# Altium project Terra.PrjPcb (part 2 of 3)

## Sheet Xilinx_DDR.SchDoc
size A3; Author: Швецов С.В.; Organization: PapuaSoft; SheetNumber: 6; SheetTotal: 8
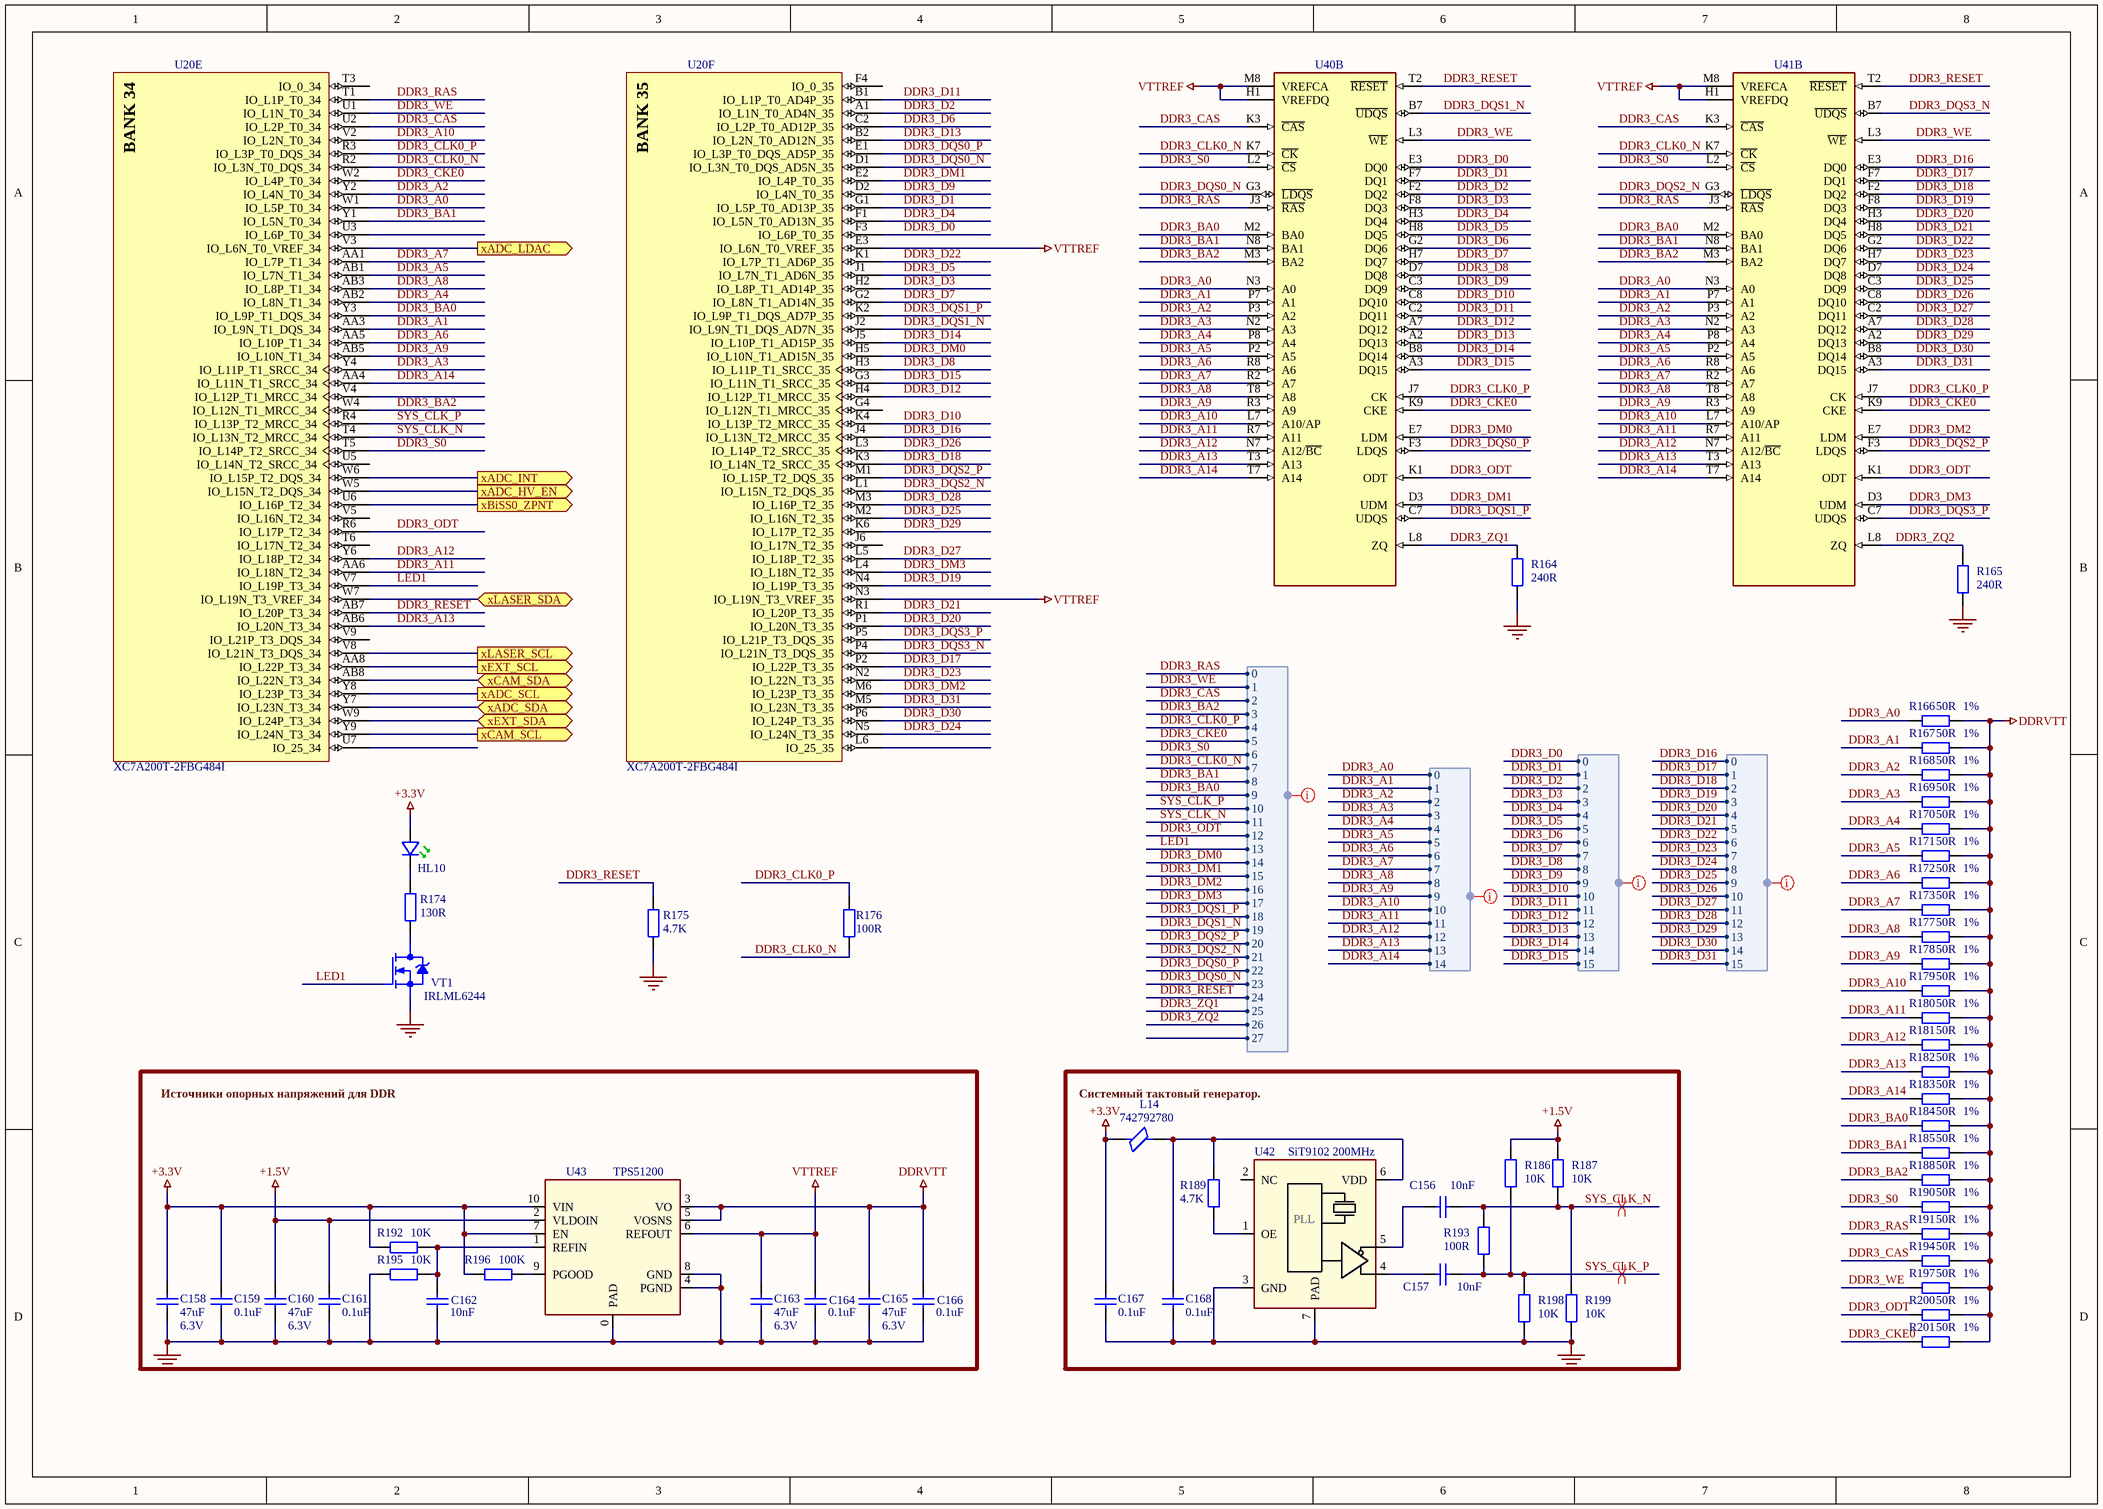
[diagram p5: Xilinx_DDR.SchDoc]

### Parts
C156  value 10nF  [C0402]  (hidden comment: Cap)
C157  value 10nF  [C0402]  (hidden comment: Cap)
C158  value 47uF  Voltage: 6.3V  [C0805]  (hidden comment: Cap)
C159  value 0.1uF  [C0402]  (hidden comment: Cap)
C160  value 47uF  Voltage: 6.3V  [C0805]  (hidden comment: Cap)
C161  value 0.1uF  [C0402]  (hidden comment: Cap)
C162  value 10nF  [C0402]  (hidden comment: Cap)
C163  value 47uF  Voltage: 6.3V  [C0805]  (hidden comment: Cap)
C164  value 0.1uF  [C0402]  (hidden comment: Cap)
C165  value 47uF  Voltage: 6.3V  [C0805]  (hidden comment: Cap)
C166  value 0.1uF  [C0402]  (hidden comment: Cap)
C167  value 0.1uF  [C0402]  (hidden comment: Cap)
C168  value 0.1uF  [C0402]  (hidden comment: Cap)
HL10  (no value)  [KP-1608_16x08x11_L]
L14  742792780  [L0402]
R164  value 240R  [R0402]  (hidden comment: Res2)
R165  value 240R  [R0402]  (hidden comment: Res2)
R166  value 50R  Precision: 1%  [R0402]  (hidden comment: Res2)
R167  value 50R  Precision: 1%  [R0402]  (hidden comment: Res2)
R168  value 50R  Precision: 1%  [R0402]  (hidden comment: Res2)
R169  value 50R  Precision: 1%  [R0402]  (hidden comment: Res2)
R170  value 50R  Precision: 1%  [R0402]  (hidden comment: Res2)
R171  value 50R  Precision: 1%  [R0402]  (hidden comment: Res2)
R172  value 50R  Precision: 1%  [R0402]  (hidden comment: Res2)
R173  value 50R  Precision: 1%  [R0402]  (hidden comment: Res2)
R174  value 130R  [R0402]  (hidden comment: Res2)
R175  value 4.7K  [R0402]  (hidden comment: Res2)
R176  value 100R  [R0402]  (hidden comment: Res2)
R177  value 50R  Precision: 1%  [R0402]  (hidden comment: Res2)
R178  value 50R  Precision: 1%  [R0402]  (hidden comment: Res2)
R179  value 50R  Precision: 1%  [R0402]  (hidden comment: Res2)
R180  value 50R  Precision: 1%  [R0402]  (hidden comment: Res2)
R181  value 50R  Precision: 1%  [R0402]  (hidden comment: Res2)
R182  value 50R  Precision: 1%  [R0402]  (hidden comment: Res2)
R183  value 50R  Precision: 1%  [R0402]  (hidden comment: Res2)
R184  value 50R  Precision: 1%  [R0402]  (hidden comment: Res2)
R185  value 50R  Precision: 1%  [R0402]  (hidden comment: Res2)
R186  value 10K  [R0402]  (hidden comment: Res2)
R187  value 10K  [R0402]  (hidden comment: Res2)
R188  value 50R  Precision: 1%  [R0402]  (hidden comment: Res2)
R189  value 4.7K  [R0402]  (hidden comment: Res2)
R190  value 50R  Precision: 1%  [R0402]  (hidden comment: Res2)
R191  value 50R  Precision: 1%  [R0402]  (hidden comment: Res2)
R192  value 10K  [R0402]  (hidden comment: Res2)
R193  value 100R  [R0402]  (hidden comment: Res2)
R194  value 50R  Precision: 1%  [R0402]  (hidden comment: Res2)
R195  value 10K  [R0402]  (hidden comment: Res2)
R196  value 100K  [R0402]  (hidden comment: Res2)
R197  value 50R  Precision: 1%  [R0402]  (hidden comment: Res2)
R198  value 10K  [R0402]  (hidden comment: Res2)
R199  value 10K  [R0402]  (hidden comment: Res2)
R200  value 50R  Precision: 1%  [R0402]  (hidden comment: Res2)
R201  value 50R  Precision: 1%  [R0402]  (hidden comment: Res2)
U20  XC7A200T-2FBG484I  [FBG484]  (parts E,F of 11)
U40  MT41J256M16HA-125-E  [FBGA96_9X14_MRN]  (value not drawn)  (part B of 2)
U41  MT41J256M16HA-125-E  [FBGA96_9X14_MRN]  (value not drawn)  (part B of 2)
U42  SiT9102 200MHz  [SMD_AI-243N33E200.00000X_SIT-L]
U43  TPS51200  [TPS51200AQDRCRQ1]
VT1  IRLML6244  [SOT23_123]

### Ports
xADC_HV_EN (out), xADC_INT (out), xADC_LDAC (out), xADC_SCL (out), xADC_SDA (bidir), xBiSS0_ZPNT (out), xCAM_SCL (out), xCAM_SDA (bidir), xEXT_SCL (out), xEXT_SDA (bidir), xLASER_SCL (out), xLASER_SDA (bidir)

### Harnesses
DDR3_DATA: 0, 1, 2, 3, 4, 5, 6, 7, 8, 9, 10, 12, 13, 14, 15, 11
DDR3_ADDR: 0, 1, 2, 3, 4, 5, 6, 7, 8, 9, 10, 12, 13, 14, 11
DDR3_ADDR: 0, 1, 2, 3, 4, 5, 6, 7, 8, 9, 10, 12, 13, 14, 11, 15, 16, 17, 18, 19, 20, 21, 22, 23, 24, 25, 26, 27

### Nets
+1.5V: C160.1 C161.2 R186.1 R187.1 U43.2(VLDOIN)
+3.3V: C158.1 C159.2 C167.2 HL10.1(Anode) L14.1 R192.1 R196.1 U43.7(EN) U43.10(VIN)
DDRVTT: C165.1 C166.1 R166.2 R167.2 R168.2 R169.2 R170.2 R171.2 R172.2 R173.2 R177.2 R178.2 R179.2 R180.2 R181.2 R182.2 R183.2 R184.2 R185.2 R188.2 R190.2 R191.2 R194.2 R197.2 R200.2 R201.2 U43.3(VO) U43.5(VOSNS)
GND: C158.2 C159.1 C160.2 C161.1 C162.2 C163.2 C164.2 C165.2 C166.2 C167.1 C168.1 R164.1 R165.1 R175.1 R195.1 R198.2 R199.2 U42.3(GND) U42.7(PAD) U43.0(PAD) U43.4(PGND) U43.8(GND) VT1.2(Sourse)  [project net +12V_INPUT]
VTTREF: C163.1 C164.1 U20.E3(IO_L6N_T0_VREF_35) U20.N3(IO_L19N_T3_VREF_35) U40.H1(VREFDQ) U40.M8(VREFCA) U41.H1(VREFDQ) U41.M8(VREFCA) U43.6(REFOUT)
DDR3_A0: R166.1 U20.W1(IO_L5P_T0_34) U40.N3(A0) U41.N3(A0) ; harness DDR3_ADDR.0
DDR3_A1: R167.1 U20.AA3(IO_L9N_T1_DQS_34) U40.P7(A1) U41.P7(A1) ; harness DDR3_ADDR.1
DDR3_A2: R168.1 U20.Y2(IO_L4N_T0_34) U40.P3(A2) U41.P3(A2) ; harness DDR3_ADDR.2
DDR3_A3: R169.1 U20.Y4(IO_L11P_T1_SRCC_34) U40.N2(A3) U41.N2(A3) ; harness DDR3_ADDR.3
DDR3_A4: R170.1 U20.AB2(IO_L8N_T1_34) U40.P8(A4) U41.P8(A4) ; harness DDR3_ADDR.4
DDR3_A5: R171.1 U20.AB1(IO_L7N_T1_34) U40.P2(A5) U41.P2(A5) ; harness DDR3_ADDR.5
DDR3_A6: R172.1 U20.AA5(IO_L10P_T1_34) U40.R8(A6) U41.R8(A6) ; harness DDR3_ADDR.6
DDR3_A7: R173.1 U20.AA1(IO_L7P_T1_34) U40.R2(A7) U41.R2(A7) ; harness DDR3_ADDR.7
DDR3_A8: R177.1 U20.AB3(IO_L8P_T1_34) U40.T8(A8) U41.T8(A8) ; harness DDR3_ADDR.8
DDR3_A9: R178.1 U20.AB5(IO_L10N_T1_34) U40.R3(A9) U41.R3(A9) ; harness DDR3_ADDR.9
DDR3_A10: R179.1 U20.V2(IO_L2N_T0_34) U40.L7(A10/AP) U41.L7(A10/AP) ; harness DDR3_ADDR.10
DDR3_A11: R180.1 U20.AA6(IO_L18N_T2_34) U40.R7(A11) U41.R7(A11) ; harness DDR3_ADDR.11
DDR3_A12: R181.1 U20.Y6(IO_L18P_T2_34) U40.N7(A12/~{BC}) U41.N7(A12/~{BC}) ; harness DDR3_ADDR.12
DDR3_A13: R182.1 U20.AB6(IO_L20N_T3_34) U40.T3(A13) U41.T3(A13) ; harness DDR3_ADDR.13
DDR3_A14: R183.1 U20.AA4(IO_L11N_T1_SRCC_34) U40.T7(A14) U41.T7(A14) ; harness DDR3_ADDR.14
DDR3_BA0: R184.1 U20.Y3(IO_L9P_T1_DQS_34) U40.M2(BA0) U41.M2(BA0) ; harness DDR3_ADDR.9
DDR3_BA1: R185.1 U20.Y1(IO_L5N_T0_34) U40.N8(BA1) U41.N8(BA1) ; harness DDR3_ADDR.8
DDR3_BA2: R188.1 U20.W4(IO_L12N_T1_MRCC_34) U40.M3(BA2) U41.M3(BA2) ; harness DDR3_ADDR.3
DDR3_CAS: R194.1 U20.U2(IO_L2P_T0_34) U40.K3(~{CAS}) U41.K3(~{CAS}) ; harness DDR3_ADDR.2
DDR3_CKE0: R201.1 U20.W2(IO_L4P_T0_34) U40.K9(CKE) U41.K9(CKE) ; harness DDR3_ADDR.5
DDR3_CLK0_N: R176.2 U20.R2(IO_L3N_T0_DQS_34) U40.K7(~{CK}) U41.K7(~{CK}) ; harness DDR3_ADDR.7
DDR3_CLK0_P: R176.1 U20.R3(IO_L3P_T0_DQS_34) U40.J7(CK) U41.J7(CK) ; harness DDR3_ADDR.4
DDR3_D0: U20.F3(IO_L6P_T0_35) U40.E3(DQ0) ; harness DDR3_DATA.0
DDR3_D1: U20.G1(IO_L5P_T0_AD13P_35) U40.F7(DQ1) ; harness DDR3_DATA.1
DDR3_D2: U20.A1(IO_L1N_T0_AD4N_35) U40.F2(DQ2) ; harness DDR3_DATA.2
DDR3_D3: U20.H2(IO_L8P_T1_AD14P_35) U40.F8(DQ3) ; harness DDR3_DATA.3
DDR3_D4: U20.F1(IO_L5N_T0_AD13N_35) U40.H3(DQ4) ; harness DDR3_DATA.4
DDR3_D5: U20.J1(IO_L7N_T1_AD6N_35) U40.H8(DQ5) ; harness DDR3_DATA.5
DDR3_D6: U20.C2(IO_L2P_T0_AD12P_35) U40.G2(DQ6) ; harness DDR3_DATA.6
DDR3_D7: U20.G2(IO_L8N_T1_AD14N_35) U40.H7(DQ7) ; harness DDR3_DATA.7
DDR3_D8: U20.H3(IO_L11P_T1_SRCC_35) U40.D7(DQ8) ; harness DDR3_DATA.8
DDR3_D9: U20.D2(IO_L4N_T0_35) U40.C3(DQ9) ; harness DDR3_DATA.9
DDR3_D10: U20.K4(IO_L13P_T2_MRCC_35) U40.C8(DQ10) ; harness DDR3_DATA.10
DDR3_D11: U20.B1(IO_L1P_T0_AD4P_35) U40.C2(DQ11) ; harness DDR3_DATA.11
DDR3_D12: U20.H4(IO_L12P_T1_MRCC_35) U40.A7(DQ12) ; harness DDR3_DATA.12
DDR3_D13: U20.B2(IO_L2N_T0_AD12N_35) U40.A2(DQ13) ; harness DDR3_DATA.13
DDR3_D14: U20.J5(IO_L10P_T1_AD15P_35) U40.B8(DQ14) ; harness DDR3_DATA.14
DDR3_D15: U20.G3(IO_L11N_T1_SRCC_35) U40.A3(DQ15) ; harness DDR3_DATA.15
DDR3_D16: U20.J4(IO_L13N_T2_MRCC_35) U41.E3(DQ0) ; harness DDR3_DATA.0
DDR3_D17: U20.P2(IO_L22P_T3_35) U41.F7(DQ1) ; harness DDR3_DATA.1
DDR3_D18: U20.K3(IO_L14N_T2_SRCC_35) U41.F2(DQ2) ; harness DDR3_DATA.2
DDR3_D19: U20.N4(IO_L19P_T3_35) U41.F8(DQ3) ; harness DDR3_DATA.3
DDR3_D20: U20.P1(IO_L20N_T3_35) U41.H3(DQ4) ; harness DDR3_DATA.4
DDR3_D21: U20.R1(IO_L20P_T3_35) U41.H8(DQ5) ; harness DDR3_DATA.5
DDR3_D22: U20.K1(IO_L7P_T1_AD6P_35) U41.G2(DQ6) ; harness DDR3_DATA.6
DDR3_D23: U20.N2(IO_L22N_T3_35) U41.H7(DQ7) ; harness DDR3_DATA.7
DDR3_D24: U20.N5(IO_L24N_T3_35) U41.D7(DQ8) ; harness DDR3_DATA.8
DDR3_D25: U20.M2(IO_L16N_T2_35) U41.C3(DQ9) ; harness DDR3_DATA.9
DDR3_D26: U20.L3(IO_L14P_T2_SRCC_35) U41.C8(DQ10) ; harness DDR3_DATA.10
DDR3_D27: U20.L5(IO_L18P_T2_35) U41.C2(DQ11) ; harness DDR3_DATA.11
DDR3_D28: U20.M3(IO_L16P_T2_35) U41.A7(DQ12) ; harness DDR3_DATA.12
DDR3_D29: U20.K6(IO_L17P_T2_35) U41.A2(DQ13) ; harness DDR3_DATA.13
DDR3_D30: U20.P6(IO_L24P_T3_35) U41.B8(DQ14) ; harness DDR3_DATA.14
DDR3_D31: U20.M5(IO_L23N_T3_35) U41.A3(DQ15) ; harness DDR3_DATA.15
DDR3_DM0: U20.H5(IO_L10N_T1_AD15N_35) U40.E7(LDM) ; harness DDR3_ADDR.14
DDR3_DM1: U20.E2(IO_L4P_T0_35) U40.D3(UDM) ; harness DDR3_ADDR.15
DDR3_DM2: U20.M6(IO_L23P_T3_35) U41.E7(LDM) ; harness DDR3_ADDR.16
DDR3_DM3: U20.L4(IO_L18N_T2_35) U41.D3(UDM) ; harness DDR3_ADDR.17
DDR3_DQS0_N: U20.D1(IO_L3N_T0_DQS_AD5N_35) U40.G3(~{LDQS}) ; harness DDR3_ADDR.23
DDR3_DQS0_P: U20.E1(IO_L3P_T0_DQS_AD5P_35) U40.F3(LDQS) ; harness DDR3_ADDR.22
DDR3_DQS1_N: U20.J2(IO_L9N_T1_DQS_AD7N_35) U40.B7(~{UDQS}) ; harness DDR3_ADDR.19
DDR3_DQS1_P: U20.K2(IO_L9P_T1_DQS_AD7P_35) U40.C7(UDQS) ; harness DDR3_ADDR.18
DDR3_DQS2_N: U20.L1(IO_L15N_T2_DQS_35) U41.G3(~{LDQS}) ; harness DDR3_ADDR.21
DDR3_DQS2_P: U20.M1(IO_L15P_T2_DQS_35) U41.F3(LDQS) ; harness DDR3_ADDR.20
DDR3_DQS3_N: U20.P4(IO_L21N_T3_DQS_35) U41.B7(~{UDQS})
DDR3_DQS3_P: U20.P5(IO_L21P_T3_DQS_35) U41.C7(UDQS)
DDR3_ODT: R200.1 U20.R6(IO_L17P_T2_34) U40.K1(ODT) U41.K1(ODT) ; harness DDR3_ADDR.12
DDR3_RAS: R191.1 U20.T1(IO_L1P_T0_34) U40.J3(~{RAS}) U41.J3(~{RAS}) ; harness DDR3_ADDR.0
DDR3_RESET: R175.2 U20.AB7(IO_L20P_T3_34) U40.T2(~{RESET}) U41.T2(~{RESET}) ; harness DDR3_ADDR.24
DDR3_S0: R190.1 U20.T5(IO_L14P_T2_SRCC_34) U40.L2(~{CS}) U41.L2(~{CS}) ; harness DDR3_ADDR.6
DDR3_WE: R197.1 U20.U1(IO_L1N_T0_34) U40.L3(~{WE}) U41.L3(~{WE}) ; harness DDR3_ADDR.1
DDR3_ZQ1: R164.2 U40.L8(ZQ) ; harness DDR3_ADDR.25
DDR3_ZQ2: R165.2 U41.L8(ZQ) ; harness DDR3_ADDR.26
LED1: U20.V7(IO_L19P_T3_34) VT1.1(Gate) ; harness DDR3_ADDR.13
SYS_CLK_N: C156.2 R187.2 R193.1 R199.1 U20.T4(IO_L13N_T2_MRCC_34) ; harness DDR3_ADDR.11
SYS_CLK_P: C157.2 R186.2 R193.2 R198.1 U20.R4(IO_L13P_T2_MRCC_34) ; harness DDR3_ADDR.10
xADC_HV_EN: U20.W5(IO_L15N_T2_DQS_34) ; port xADC_HV_EN
xADC_INT: U20.W6(IO_L15P_T2_DQS_34) ; port xADC_INT
xADC_LDAC: U20.V3(IO_L6N_T0_VREF_34) ; port xADC_LDAC
xADC_SCL: U20.Y8(IO_L23P_T3_34) ; port xADC_SCL
xADC_SDA: U20.Y7(IO_L23N_T3_34) ; port xADC_SDA
xBiSS0_ZPNT: U20.U6(IO_L16P_T2_34) ; port xBiSS0_ZPNT
xBiSS1_CLK: U20.AA8(IO_L22P_T3_34) ; port xEXT_SCL
xCAM_SCL: U20.Y9(IO_L24N_T3_34) ; port xCAM_SCL
xCAM_SDA: U20.AB8(IO_L22N_T3_34) ; port xCAM_SDA
xEXT_SDA: U20.W9(IO_L24P_T3_34) ; port xEXT_SDA
xLS_SCL: U20.V8(IO_L21N_T3_DQS_34) ; port xLASER_SCL
xLS_SDA: U20.W7(IO_L19N_T3_VREF_34) ; port xLASER_SDA
NetC156_1: C156.1 U42.5(CLKN)
NetC157_1: C157.1 U42.4(CLKP)
NetC162_1: C162.1 R192.2 R195.2 U43.1(REFIN)
NetC168_2: C168.2 L14.2 R189.2 U42.6(VDD)
NetHL10_2: HL10.2(Cathode) R174.2
NetR174_1: R174.1 VT1.3(Drain)
NetR189_1: R189.1 U42.1(OE)
NetR196_2: R196.2 U43.9(PGOOD)

Not connected (* = marked no-connect by the designer): U20 F4(IO_0_35) G4(IO_L12N_T1_MRCC_35) J6(IO_L17N_T2_35) L6(IO_25_35) T3(IO_0_34) T6(IO_L17N_T2_34) U3(IO_L6P_T0_34) U5(IO_L14N_T2_SRCC_34) U7(IO_25_34) V4(IO_L12P_T1_MRCC_34) V5(IO_L16N_T2_34) V9(IO_L21P_T3_DQS_34); U42 2(NC); U43 173 174

### Layout directives
net class DDR_DATA_0_15: (no net found under the mark)
net class DDR_DATA_16_31: (no net found under the mark)
net class DDR_ADDR: (no net found under the mark)
net class PLIS_OTHER: (no net found under the mark)
differential pair: SYS_CLK_N, SYS_CLK_P

### Notes on the sheet
- Источники опорных напряжений для DDR
- (near L14) Системный тактовый генератор.
- Лист
- /
- Изм.
- № докум.
- Подп.
- Дата.
- (in symbol SiT9102) PLL
- (in symbol XC7A200T-2FBG484I, part E) BANK 34
- (in symbol XC7A200T-2FBG484I, part F) BANK 35

### Library data of the parts
C156 C157 C159 C161 C162 C164 C166-C168 = Cap: Конденсатор керамический; Voltage: 25V; PackageReference: 0402
  C156 C157 C159 C161 C167 C168: ClassName: SystemCLK
  C162 C164 C166: ClassName: Xilinx DDR
C158 C160 C163 C165 = Cap: C0805C476M9PAC; PackageReference: 0805; ClassName: Xilinx PWR
HL10 = ledG_KP-1608MGC_KP-1608: 1.6X0.8mm SMD  LED; LxWxH(mm): 1,6x0,8x1,1; Value: KP-1608MGC; PackageReference: 0603; Package: KP-1608_16x08x11
L14 = BEAD_FERRITE_SM: Wurth Elektronik EMI FILTERS FERRITE BEAD, 220R@100MHz, 0.35R; PackageReference: 0402; Value: 742792780; ClassName: SystemCLK
R164-R191 R193 R194 R196-R201 = Res2: Резистор; PackageReference: 0402
  R164-R173 R175-R185 R188 R190 R191 R194 R196 R197 R200 R201: ClassName: Xilinx DDR
  R186 R187 R189 R193 R198 R199: ClassName: SystemCLK
R192 R195 = Res2: Резистор; Precision: 1%; PackageReference: 0402; ClassName: Xilinx DDR
U20 = XC7A200T-2FBG484I: Artix-7 FPGA, 285 User I/Os, 4 GTP, 484-Ball BGA; Manufacturer: Xilinx; CLBs (Slices): 33650; DSP48E1 Slices: 740; Block RAM Blocks (36Kb): 365; Logic Cells: 215360; Block RAM Blocks (Max Kb): 13140; Speed Grade: -2; Clock Mgmt Tiles (CMTs): 10; Block RAM Blocks (18Kb): 730; Max User I/O: 500; ComponentLink5Description: Packaging and Pinout; CLBs (Max Distributed RAM Kb): 2888; ComponentLink4Description: Package File; ComponentLink5URL: http://www.xilinx.com/support/documentation/user_guides/ug475_7Series_Pkg_Pinout.pdf; ComponentLink1Description: Datasheet; ComponentLink2Description: Package Specification; DatasheetVersion: v1.12; ComponentLink3URL: http://www.xilinx.com/support/documentation/data_sheets/ds181_Artix_7_Data_Sheet.pdf; ComponentLink1URL: http://www.xilinx.com/support/documentation/data_sheets/ds180_7Series_Overview.pdf; Code_JEDEC: MS-034; ComponentLink2URL: http://www.xilinx.com/support/documentation/user_guides/ug475_7Series_Pkg_Pinout.pdf; ComponentLink3Description: DC and Switching Characteristics; Generic Part Number: XC7A200T; RoHS: Pb-Free; ComponentLink4URL: http://www.xilinx.com/support/packagefiles/a7packages/xc7a200tfbg484pkg.txt; PackageVersion: Rev 1.8; Mounting Technology: Surface Mount; PackageReference: FBG484; PackageDescription: Flip-Chip Lidless BGA, Body 23 x 23 mm, 1.0 mm Pitch; Value: XC7A200T-2FBG484I; ClassName: *
U40 U41 = MT41J256M16HA-125-E: DDR3 SDRAM 32Meg x 16 x 8 banks; Value: MT41J256M16HA-125-E; PackageReference: FBGA-96
U42 = SiT9102: 200 MHz XO LVDS Oscillator 3.3V; Value: SIT9102AI-243N33E200.00000X; PackageReference: SMD 5.0x3.2x0.75; ClassName: SystemCLK
U43 = TPS51200: Sink and Source DDR Termination Regulator; Value: TPS51200; PackageReference: VSON10; ClassName: Xilinx DDR
VT1 = MOSFET-N/SOT23: MOSFET-N 1.5V порог переключения.; Value: IRLML6244TRPbF; PackageReference: SOT23

## Sheet Xilinx_pwr.SchDoc
size A3; Author: Швецов С.В.; Organization: PapuaSoft; SheetNumber: 6; SheetTotal: 8
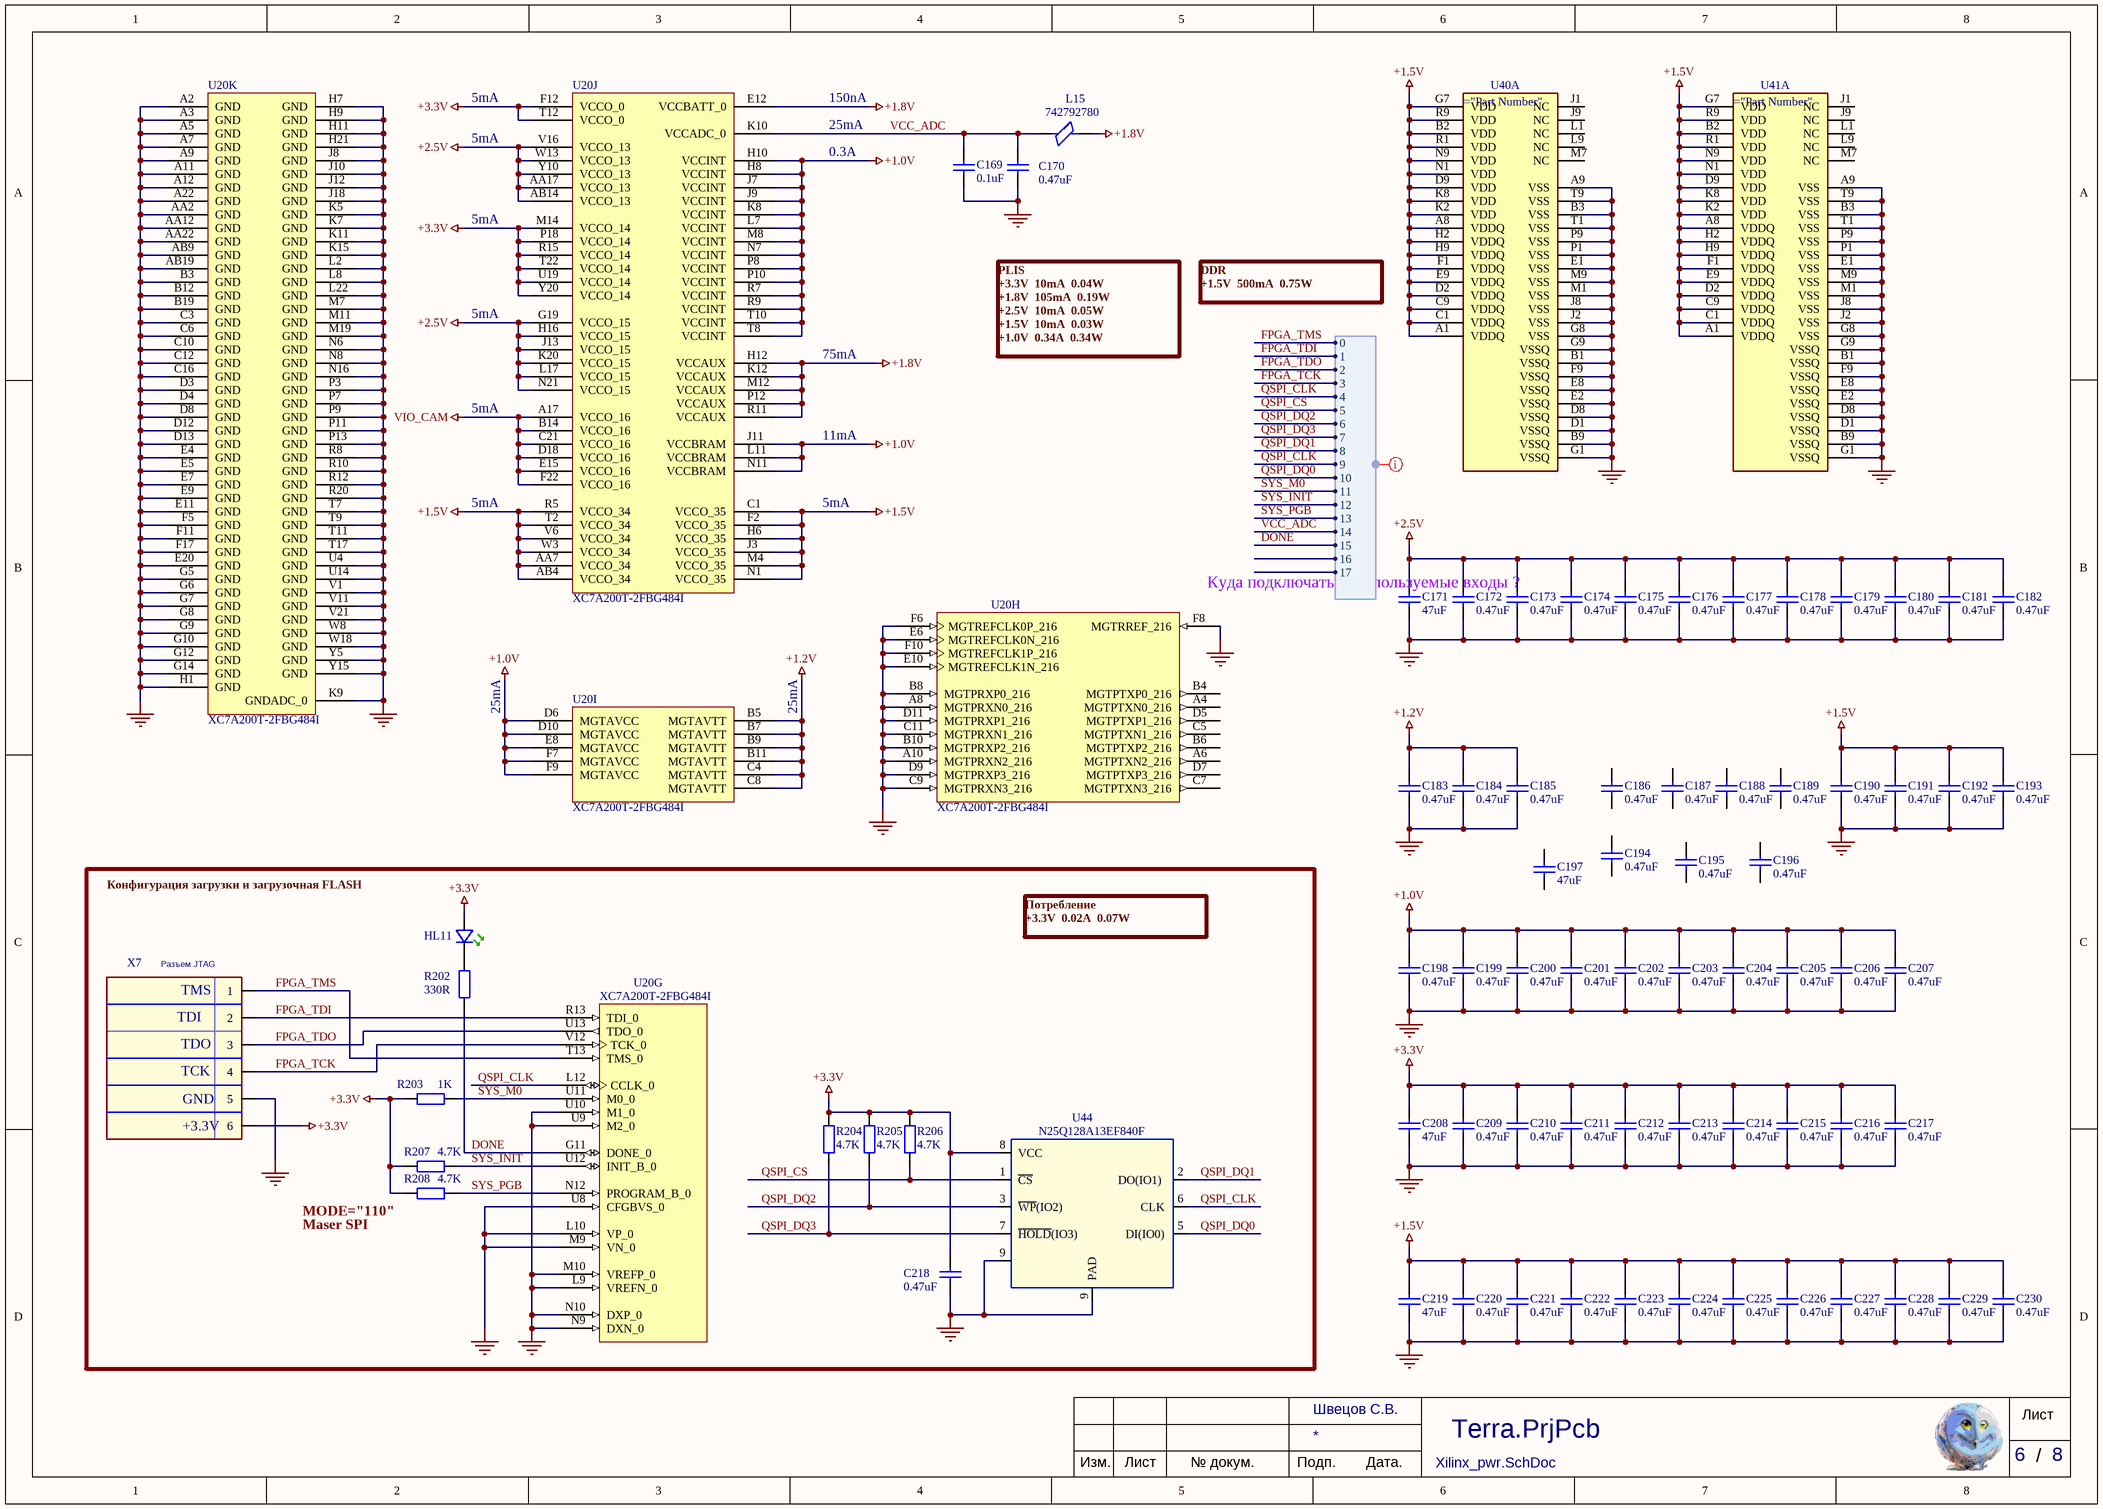
[diagram p6: Xilinx_pwr.SchDoc]

### Parts
C169  value 0.1uF  [C0402]  (hidden comment: Cap)
C170  value 0.47uF  [C0402]  (hidden comment: Cap)
C171  value 47uF  [C0805]  (hidden comment: Cap)
C172  value 0.47uF  [C0402]  (hidden comment: Cap)
C173  value 0.47uF  [C0402]  (hidden comment: Cap)
C174  value 0.47uF  [C0402]  (hidden comment: Cap)
C175  value 0.47uF  [C0402]  (hidden comment: Cap)
C176  value 0.47uF  [C0402]  (hidden comment: Cap)
C177  value 0.47uF  [C0402]  (hidden comment: Cap)
C178  value 0.47uF  [C0402]  (hidden comment: Cap)
C179  value 0.47uF  [C0402]  (hidden comment: Cap)
C180  value 0.47uF  [C0402]  (hidden comment: Cap)
C181  value 0.47uF  [C0402]  (hidden comment: Cap)
C182  value 0.47uF  [C0402]  (hidden comment: Cap)
C183  value 0.47uF  [C0402]  (hidden comment: Cap)
C184  value 0.47uF  [C0402]  (hidden comment: Cap)
C185  value 0.47uF  [C0402]  (hidden comment: Cap)
C186  value 0.47uF  [C0402]  (hidden comment: Cap)
C187  value 0.47uF  [C0402]  (hidden comment: Cap)
C188  value 0.47uF  [C0402]  (hidden comment: Cap)
C189  value 0.47uF  [C0402]  (hidden comment: Cap)
C190  value 0.47uF  [C0402]  (hidden comment: Cap)
C191  value 0.47uF  [C0402]  (hidden comment: Cap)
C192  value 0.47uF  [C0402]  (hidden comment: Cap)
C193  value 0.47uF  [C0402]  (hidden comment: Cap)
C194  value 0.47uF  [C0402]  (hidden comment: Cap)
C195  value 0.47uF  [C0402]  (hidden comment: Cap)
C196  value 0.47uF  [C0402]  (hidden comment: Cap)
C197  value 47uF  [C0805]  (hidden comment: Cap)
C198  value 0.47uF  [C0402]  (hidden comment: Cap)
C199  value 0.47uF  [C0402]  (hidden comment: Cap)
C200  value 0.47uF  [C0402]  (hidden comment: Cap)
C201  value 0.47uF  [C0402]  (hidden comment: Cap)
C202  value 0.47uF  [C0402]  (hidden comment: Cap)
C203  value 0.47uF  [C0402]  (hidden comment: Cap)
C204  value 0.47uF  [C0402]  (hidden comment: Cap)
C205  value 0.47uF  [C0402]  (hidden comment: Cap)
C206  value 0.47uF  [C0402]  (hidden comment: Cap)
C207  value 0.47uF  [C0402]  (hidden comment: Cap)
C208  value 47uF  [C0805]  (hidden comment: Cap)
C209  value 0.47uF  [C0402]  (hidden comment: Cap)
C210  value 0.47uF  [C0402]  (hidden comment: Cap)
C211  value 0.47uF  [C0402]  (hidden comment: Cap)
C212  value 0.47uF  [C0402]  (hidden comment: Cap)
C213  value 0.47uF  [C0402]  (hidden comment: Cap)
C214  value 0.47uF  [C0402]  (hidden comment: Cap)
C215  value 0.47uF  [C0402]  (hidden comment: Cap)
C216  value 0.47uF  [C0402]  (hidden comment: Cap)
C217  value 0.47uF  [C0402]  (hidden comment: Cap)
C218  value 0.47uF  [C0402]  (hidden comment: Cap)
C219  value 47uF  [C0805]  (hidden comment: Cap)
C220  value 0.47uF  [C0402]  (hidden comment: Cap)
C221  value 0.47uF  [C0402]  (hidden comment: Cap)
C222  value 0.47uF  [C0402]  (hidden comment: Cap)
C223  value 0.47uF  [C0402]  (hidden comment: Cap)
C224  value 0.47uF  [C0402]  (hidden comment: Cap)
C225  value 0.47uF  [C0402]  (hidden comment: Cap)
C226  value 0.47uF  [C0402]  (hidden comment: Cap)
C227  value 0.47uF  [C0402]  (hidden comment: Cap)
C228  value 0.47uF  [C0402]  (hidden comment: Cap)
C229  value 0.47uF  [C0402]  (hidden comment: Cap)
C230  value 0.47uF  [C0402]  (hidden comment: Cap)
HL11  (no value)  [KP-1608_16x08x11_L]
L15  742792780  [L0402]
R202  value 330R  [R0402]  (hidden comment: Res2)
R203  value 1K  [R0402]  (hidden comment: Res2)
R204  value 4.7K  [R0402]  (hidden comment: Res2)
R205  value 4.7K  [R0402]  (hidden comment: Res2)
R206  value 4.7K  [R0402]  (hidden comment: Res2)
R207  value 4.7K  [R0402]  (hidden comment: Res2)
R208  value 4.7K  [R0402]  (hidden comment: Res2)
U20  XC7A200T-2FBG484I  [FBG484]  (parts G,H,I,J,K of 11)
U40  MT41J256M16HA-125-E  [FBGA96_9X14_MRN]  (value not drawn)  (part A of 2)
U41  MT41J256M16HA-125-E  [FBGA96_9X14_MRN]  (value not drawn)  (part A of 2)
U44  N25Q128A13EF840F  [VPDFN8_8X6_MRN-L]
X7  Разъем JTAG  [HEADER-1X6S]

### Harnesses
SYSTEM: 0, 1, 2, 3, 4, 5, 6, 7, 8, 9, 11, 12, 10, 13, 14, 15, 16, 17

### Nets
+1.0V: C198.1 C199.1 C200.1 C201.1 C202.1 C203.1 C204.1 C205.1 C206.1 C207.1 U20.D6(MGTAVCC) U20.D10(MGTAVCC) U20.E8(MGTAVCC) U20.F7(MGTAVCC) U20.F9(MGTAVCC) U20.H8(VCCINT) U20.H10(VCCINT) U20.J7(VCCINT) U20.J9(VCCINT) U20.J11(VCCBRAM) U20.K8(VCCINT) U20.L7(VCCINT) U20.L11(VCCBRAM) U20.M8(VCCINT) U20.N7(VCCINT) U20.N11(VCCBRAM) U20.P8(VCCINT) U20.P10(VCCINT) U20.R7(VCCINT) U20.R9(VCCINT) U20.T8(VCCINT) U20.T10(VCCINT)
+1.2V: C183.1 C184.1 C185.1 U20.B5(MGTAVTT) U20.B7(MGTAVTT) U20.B9(MGTAVTT) U20.B11(MGTAVTT) U20.C4(MGTAVTT) U20.C8(MGTAVTT)
+1.5V: C190.1 C191.1 C192.1 C193.1 C219.1 C220.1 C221.1 C222.1 C223.1 C224.1 C225.1 C226.1 C227.1 C228.1 C229.1 C230.1 U20.AA7(VCCO_34) U20.AB4(VCCO_34) U20.C1(VCCO_35) U20.F2(VCCO_35) U20.H6(VCCO_35) U20.J3(VCCO_35) U20.M4(VCCO_35) U20.N1(VCCO_35) U20.R5(VCCO_34) U20.T2(VCCO_34) U20.V6(VCCO_34) U20.W3(VCCO_34) U40.A1(VDDQ) U40.A8(VDDQ) U40.B2(VDD) U40.C1(VDDQ) U40.C9(VDDQ) U40.D2(VDDQ) U40.D9(VDD) U40.E9(VDDQ) U40.F1(VDDQ) U40.G7(VDD) U40.H2(VDDQ) U40.H9(VDDQ) U40.K2(VDD) U40.K8(VDD) U40.N1(VDD) U40.N9(VDD) U40.R1(VDD) U40.R9(VDD) U41.A1(VDDQ) U41.A8(VDDQ) U41.B2(VDD) U41.C1(VDDQ) U41.C9(VDDQ) U41.D2(VDDQ) U41.D9(VDD) U41.E9(VDDQ) U41.F1(VDDQ) U41.G7(VDD) U41.H2(VDDQ) U41.H9(VDDQ) U41.K2(VDD) U41.K8(VDD) U41.N1(VDD) U41.N9(VDD) U41.R1(VDD) U41.R9(VDD)
+1.8V: L15.2 U20.E12(VCCBATT_0) U20.H12(VCCAUX) U20.K12(VCCAUX) U20.M12(VCCAUX) U20.P12(VCCAUX) U20.R11(VCCAUX)
+2.5V: C171.1 C172.1 C173.1 C174.1 C175.1 C176.1 C177.1 C178.1 C179.1 C180.1 C181.1 C182.1 U20.AA17(VCCO_13) U20.AB14(VCCO_13) U20.G19(VCCO_15) U20.H16(VCCO_15) U20.J13(VCCO_15) U20.K20(VCCO_15) U20.L17(VCCO_15) U20.N21(VCCO_15) U20.V16(VCCO_13) U20.W13(VCCO_13) U20.Y10(VCCO_13)
+3.3V: C208.1 C209.1 C210.1 C211.1 C212.1 C213.1 C214.1 C215.1 C216.1 C217.1 C218.1 HL11.1(Anode) R203.1 R204.2 R205.2 R206.2 R207.1 R208.1 U20.F12(VCCO_0) U20.M14(VCCO_14) U20.P18(VCCO_14) U20.R15(VCCO_14) U20.T12(VCCO_0) U20.T22(VCCO_14) U20.U19(VCCO_14) U20.Y20(VCCO_14) U44.8(VCC) X7.6
GND: C169.2 C170.2 C171.2 C172.2 C173.2 C174.2 C175.2 C176.2 C177.2 C178.2 C179.2 C180.2 C181.2 C182.2 C183.2 C184.2 C185.2 C190.2 C191.2 C192.2 C193.2 C198.2 C199.2 C200.2 C201.2 C202.2 C203.2 C204.2 C205.2 C206.2 C207.2 C208.2 C209.2 C210.2 C211.2 C212.2 C213.2 C214.2 C215.2 C216.2 C217.2 C218.2 C219.2 C220.2 C221.2 C222.2 C223.2 C224.2 C225.2 C226.2 C227.2 C228.2 C229.2 C230.2 U20.A2(GND) U20.A3(GND) U20.A5(GND) U20.A7(GND) U20.A8(MGTPRXN0_216) U20.A9(GND) U20.A10(MGTPRXN2_216) U20.A11(GND) U20.A12(GND) U20.A22(GND) U20.AA2(GND) U20.AA12(GND) U20.AA22(GND) U20.AB9(GND) U20.AB19(GND) U20.B3(GND) U20.B8(MGTPRXP0_216) U20.B10(MGTPRXP2_216) U20.B12(GND) U20.B19(GND) U20.C3(GND) U20.C6(GND) U20.C9(MGTPRXN3_216) U20.C10(GND) U20.C11(MGTPRXN1_216) U20.C12(GND) U20.C16(GND) U20.D3(GND) U20.D4(GND) U20.D8(GND) U20.D9(MGTPRXP3_216) U20.D11(MGTPRXP1_216) U20.D12(GND) U20.D13(GND) U20.E4(GND) U20.E5(GND) U20.E6(MGTREFCLK0N_216) U20.E7(GND) U20.E9(GND) U20.E10(MGTREFCLK1N_216) U20.E11(GND) U20.E20(GND) U20.F5(GND) U20.F6(MGTREFCLK0P_216) U20.F8(MGTRREF_216) U20.F10(MGTREFCLK1P_216) U20.F11(GND) U20.F17(GND) U20.G5(GND) U20.G6(GND) U20.G7(GND) U20.G8(GND) U20.G9(GND) U20.G10(GND) U20.G12(GND) U20.G14(GND) U20.H1(GND) U20.H7(GND) U20.H9(GND) U20.H11(GND) U20.H21(GND) U20.J8(GND) U20.J10(GND) U20.J12(GND) U20.J18(GND) U20.K5(GND) U20.K7(GND) U20.K9(GNDADC_0) U20.K11(GND) U20.K15(GND) U20.L2(GND) U20.L8(GND) U20.L9(VREFN_0) U20.L10(VP_0) U20.L22(GND) U20.M7(GND) U20.M9(VN_0) U20.M10(VREFP_0) U20.M11(GND) U20.M19(GND) U20.N6(GND) U20.N8(GND) U20.N9(DXN_0) U20.N10(DXP_0) U20.N16(GND) U20.P3(GND) U20.P7(GND) U20.P9(GND) U20.P11(GND) U20.P13(GND) U20.R8(GND) U20.R10(GND) U20.R12(GND) U20.R20(GND) U20.T7(GND) U20.T9(GND) U20.T11(GND) U20.T17(GND) U20.U4(GND) U20.U8(CFGBVS_0) U20.U9(M2_0) U20.U10(M1_0) U20.U14(GND) U20.V1(GND) U20.V11(GND) U20.V21(GND) U20.W8(GND) U20.W18(GND) U20.Y5(GND) U20.Y15(GND) U40.A9(VSS) U40.B1(VSSQ) U40.B3(VSS) U40.B9(VSSQ) U40.D1(VSSQ) U40.D8(VSSQ) U40.E1(VSS) U40.E2(VSSQ) U40.E8(VSSQ) U40.F9(VSSQ) U40.G1(VSSQ) U40.G8(VSS) U40.G9(VSSQ) U40.J2(VSS) U40.J8(VSS) U40.M1(VSS) U40.M9(VSS) U40.P1(VSS) U40.P9(VSS) U40.T1(VSS) U40.T9(VSS) U41.A9(VSS) U41.B1(VSSQ) U41.B3(VSS) U41.B9(VSSQ) U41.D1(VSSQ) U41.D8(VSSQ) U41.E1(VSS) U41.E2(VSSQ) U41.E8(VSSQ) U41.F9(VSSQ) U41.G1(VSSQ) U41.G8(VSS) U41.G9(VSSQ) U41.J2(VSS) U41.J8(VSS) U41.M1(VSS) U41.M9(VSS) U41.P1(VSS) U41.P9(VSS) U41.T1(VSS) U41.T9(VSS) U44.9 X7.5  [project net +12V_INPUT]
VIO_CAM: U20.A17(VCCO_16) U20.B14(VCCO_16) U20.C21(VCCO_16) U20.D18(VCCO_16) U20.E15(VCCO_16) U20.F22(VCCO_16)
DONE: R202.1 U20.G11(DONE_0) ; harness SYSTEM.15
FPGA_TCK: U20.V12(TCK_0) X7.4 ; harness SYSTEM.3
FPGA_TDI: U20.R13(TDI_0) X7.2 ; harness SYSTEM.1
FPGA_TDO: U20.U13(TDO_0) X7.3 ; harness SYSTEM.2
FPGA_TMS: U20.T13(TMS_0) X7.1 ; harness SYSTEM.0
QSPI_CLK: U20.L12(CCLK_0) U44.6(CLK) ; harness SYSTEM.4, harness SYSTEM.9
QSPI_CS: R206.1 U44.1(~{CS}) ; harness SYSTEM.5
QSPI_DQ0: U44.5(DI(IO0)) ; harness SYSTEM.10
QSPI_DQ1: U44.2(DO(IO1)) ; harness SYSTEM.8
QSPI_DQ2: R205.1 U44.3(~{WP}(IO2)) ; harness SYSTEM.6
QSPI_DQ3: R204.1 U44.7(~{HOLD}(IO3)) ; harness SYSTEM.7
SYS_INIT: R207.2 U20.U12(INIT_B_0) ; harness SYSTEM.12
SYS_M0: R203.2 U20.U11(M0_0) ; harness SYSTEM.11
SYS_PGB: R208.2 U20.N12(PROGRAM_B_0) ; harness SYSTEM.13
VCC_ADC: C169.1 C170.1 L15.1 U20.K10(VCCADC_0) ; harness SYSTEM.14
NetHL11_2: HL11.2(Cathode) R202.2

Not connected (* = marked no-connect by the designer): C186 1 2; C187 1 2; C188 1 2; C189 1 2; C194 1 2; C195 1 2; C196 1 2; C197 1 2; U20 A4(MGTPTXN0_216) A6(MGTPTXN2_216) B4(MGTPTXP0_216) B6(MGTPTXP2_216) C5(MGTPTXN1_216) C7(MGTPTXN3_216) D5(MGTPTXP1_216) D7(MGTPTXP3_216); U40 J1(NC) J9(NC) L1(NC) L9(NC) M7(NC); U41 J1(NC) J9(NC) L1(NC) L9(NC) M7(NC)

### Layout directives
net class PLIS_SYS: (no net found under the mark)

### Notes on the sheet
- 5mA
- 150nA
- 25mA
- 0.3A
- DDR
  +1.5V  500mA  0.75W
- 75mA
- PLIS
  +3.3V  10mA  0.04W
  +1.8V  105mA  0.19W
  +2.5V  10mA  0.05W
  +1.5V  10mA  0.03W
  +1.0V  0.34A  0.34W
- 11mA
- (near U20) Куда подключать неиспользуемые входы ?
- (near U20) 25mA
- Конфигурация загрузки и загрузочная FLASH
- Потребление
  +3.3V  0.02A  0.07W
- TDI
- TMS
- TDO
- TCK
- GND
- +3.3V
- MODE="110"
- Maser SPI
- Лист
- /
- Изм.
- № докум.
- Подп.
- Дата.

### Library data of the parts
C169 = Cap: Конденсатор керамический; Voltage: 25V; PackageReference: 0402; ClassName: Xilinx PWR
C170 C172-C196 C198-C207 C209-C218 C220-C230 = Cap: Конденсатор керамический; Voltage: 10V; PackageReference: 0402; ClassName: Xilinx PWR
C171 C197 C208 C219 = Cap: C0805C476M9PAC; Voltage: 6.3V; PackageReference: 0805; ClassName: Xilinx PWR
HL11 = ledG_KP-1608MGC_KP-1608: as HL10 on sheet Xilinx_DDR; Value: KP-1608MGC; PackageReference: 0603; Package: KP-1608_16x08x11; ClassName: Xilinx_SYS
L15 = BEAD_FERRITE_SM: as L14 on sheet Xilinx_DDR; PackageReference: 0402; Value: 742792780; ClassName: Xilinx PWR
R202-R208 = Res2: Резистор; PackageReference: 0402; ClassName: Xilinx_SYS
U20 = XC7A200T-2FBG484I: as U20 on sheet Xilinx_DDR; ComponentLink5Description: Packaging and Pinout; CLBs (Max Distributed RAM Kb): 2888; ComponentLink4Description: Package File; ComponentLink5URL: http://www.xilinx.com/support/documentation/user_guides/ug475_7Series_Pkg_Pinout.pdf; ComponentLink1Description: Datasheet; ComponentLink2Description: Package Specification; DatasheetVersion: v1.12; ComponentLink3URL: http://www.xilinx.com/support/documentation/data_sheets/ds181_Artix_7_Data_Sheet.pdf; ComponentLink1URL: http://www.xilinx.com/support/documentation/data_sheets/ds180_7Series_Overview.pdf; Code_JEDEC: MS-034; ComponentLink2URL: http://www.xilinx.com/support/documentation/user_guides/ug475_7Series_Pkg_Pinout.pdf; ComponentLink3Description: DC and Switching Characteristics; Generic Part Number: XC7A200T; RoHS: Pb-Free; ComponentLink4URL: http://www.xilinx.com/support/packagefiles/a7packages/xc7a200tfbg484pkg.txt; PackageVersion: Rev 1.8; Mounting Technology: Surface Mount; PackageReference: FBG484; PackageDescription: Flip-Chip Lidless BGA, Body 23 x 23 mm, 1.0 mm Pitch; Value: XC7A200T-2FBG484I; ClassName: *
U40 U41 = MT41J256M16HA-125-E: DDR3 SDRAM 32Meg x 16 x 8 banks; Value: MT41J256M16HA-125-E; PackageReference: FBGA-96
U44 = N25Q128A13EF840F: Serial NOR Flash 128Mb 3V; Value: N25Q128A13EF840F; PackageReference: MLP8; ClassName: Xilinx_SYS
X7 = CON1x6: Value: CON1x6; ClassName: Xilinx_SYS

## Sheet ADC.SchDoc
size A3; Author: Швецов С.В.; Organization: PapuaSoft; SheetNumber: 2; SheetTotal: 8
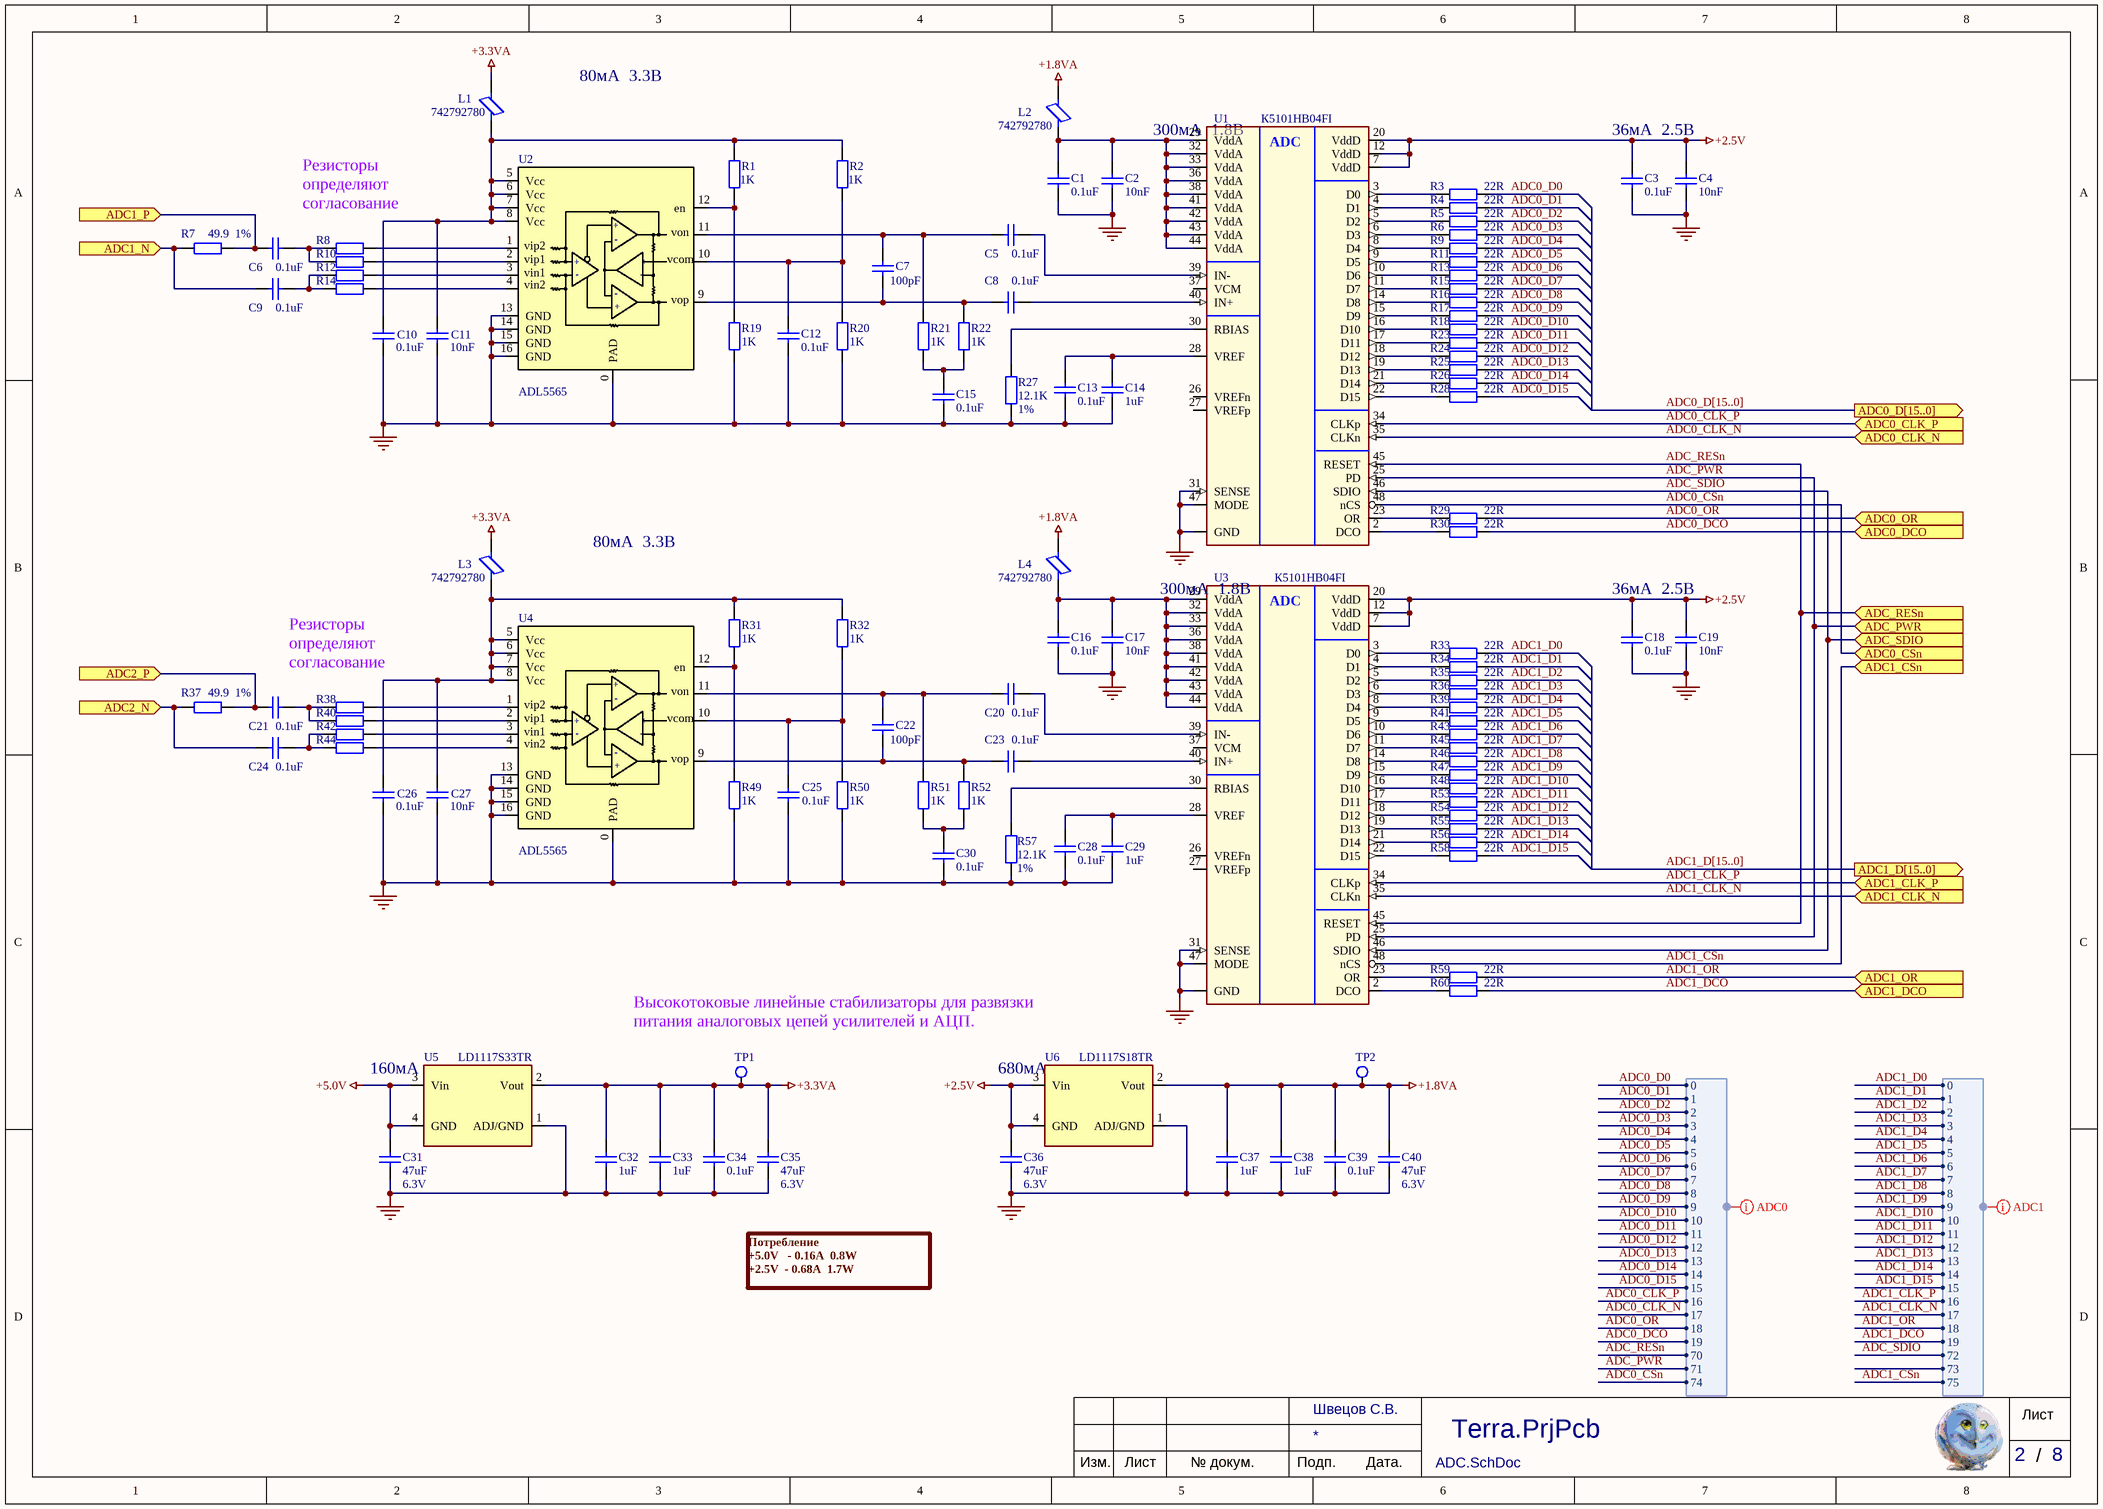
[diagram p7: ADC.SchDoc]

### Parts
C1  value 0.1uF  [C0402]  (hidden comment: Cap)
C2  value 10nF  [C0402]  (hidden comment: Cap)
C3  value 0.1uF  [C0402]  (hidden comment: Cap)
C4  value 10nF  [C0402]  (hidden comment: Cap)
C5  value 0.1uF  [C0402]  (hidden comment: Cap)
C6  value 0.1uF  [C0402]  (hidden comment: Cap)
C7  value 100pF  [C0402]  (hidden comment: Cap)
C8  value 0.1uF  [C0402]  (hidden comment: Cap)
C9  value 0.1uF  [C0402]  (hidden comment: Cap)
C10  value 0.1uF  [C0402]  (hidden comment: Cap)
C11  value 10nF  [C0402]  (hidden comment: Cap)
C12  value 0.1uF  [C0402]  (hidden comment: Cap)
C13  value 0.1uF  [C0402]  (hidden comment: Cap)
C14  value 1uF  [C0603]  (hidden comment: Cap)
C15  value 0.1uF  [C0402]  (hidden comment: Cap)
C16  value 0.1uF  [C0402]  (hidden comment: Cap)
C17  value 10nF  [C0402]  (hidden comment: Cap)
C18  value 0.1uF  [C0402]  (hidden comment: Cap)
C19  value 10nF  [C0402]  (hidden comment: Cap)
C20  value 0.1uF  [C0402]  (hidden comment: Cap)
C21  value 0.1uF  [C0402]  (hidden comment: Cap)
C22  value 100pF  [C0402]  (hidden comment: Cap)
C23  value 0.1uF  [C0402]  (hidden comment: Cap)
C24  value 0.1uF  [C0402]  (hidden comment: Cap)
C25  value 0.1uF  [C0402]  (hidden comment: Cap)
C26  value 0.1uF  [C0402]  (hidden comment: Cap)
C27  value 10nF  [C0402]  (hidden comment: Cap)
C28  value 0.1uF  [C0402]  (hidden comment: Cap)
C29  value 1uF  [C0603]  (hidden comment: Cap)
C30  value 0.1uF  [C0402]  (hidden comment: Cap)
C31  value 47uF  Voltage: 6.3V  [C0805]  (hidden comment: Cap)
C32  value 1uF  [C0603]  (hidden comment: Cap)
C33  value 1uF  [C0603]  (hidden comment: Cap)
C34  value 0.1uF  [C0402]  (hidden comment: Cap)
C35  value 47uF  Voltage: 6.3V  [C0805]  (hidden comment: Cap)
C36  value 47uF  Voltage: 6.3V  [C0805]  (hidden comment: Cap)
C37  value 1uF  [C0603]  (hidden comment: Cap)
C38  value 1uF  [C0603]  (hidden comment: Cap)
C39  value 0.1uF  [C0402]  (hidden comment: Cap)
C40  value 47uF  Voltage: 6.3V  [C0805]  (hidden comment: Cap)
L1  742792780  [L0402]
L2  742792780  [L0402]
L3  742792780  [L0402]
L4  742792780  [L0402]
R1  value 1K  [R0402]  (hidden comment: Res2)
R2  value 1K  [R0402]  (hidden comment: Res2)
R3  value 22R  [R0402]  (hidden comment: Res2)
R4  value 22R  [R0402]  (hidden comment: Res2)
R5  value 22R  [R0402]  (hidden comment: Res2)
R6  value 22R  [R0402]  (hidden comment: Res2)
R7  value 49.9  Precision: 1%  [R0402]  (hidden comment: Res2)
R8  Res2  [R0402]  (value not drawn)
R9  value 22R  [R0402]  (hidden comment: Res2)
R10  Res2  [R0402]  (value not drawn)
R11  value 22R  [R0402]  (hidden comment: Res2)
R12  Res2  [R0402]  (value not drawn)
R13  value 22R  [R0402]  (hidden comment: Res2)
R14  Res2  [R0402]  (value not drawn)
R15  value 22R  [R0402]  (hidden comment: Res2)
R16  value 22R  [R0402]  (hidden comment: Res2)
R17  value 22R  [R0402]  (hidden comment: Res2)
R18  value 22R  [R0402]  (hidden comment: Res2)
R19  value 1K  [R0402]  (hidden comment: Res2)
R20  value 1K  [R0402]  (hidden comment: Res2)
R21  value 1K  [R0402]  (hidden comment: Res2)
R22  value 1K  [R0402]  (hidden comment: Res2)
R23  value 22R  [R0402]  (hidden comment: Res2)
R24  value 22R  [R0402]  (hidden comment: Res2)
R25  value 22R  [R0402]  (hidden comment: Res2)
R26  value 22R  [R0402]  (hidden comment: Res2)
R27  value 12.1K  Precision: 1%  [R0402]  (hidden comment: Res2)
R28  value 22R  [R0402]  (hidden comment: Res2)
R29  value 22R  [R0402]  (hidden comment: Res2)
R30  value 22R  [R0402]  (hidden comment: Res2)
R31  value 1K  [R0402]  (hidden comment: Res2)
R32  value 1K  [R0402]  (hidden comment: Res2)
R33  value 22R  [R0402]  (hidden comment: Res2)
R34  value 22R  [R0402]  (hidden comment: Res2)
R35  value 22R  [R0402]  (hidden comment: Res2)
R36  value 22R  [R0402]  (hidden comment: Res2)
R37  value 49.9  Precision: 1%  [R0402]  (hidden comment: Res2)
R38  Res2  [R0402]  (value not drawn)
R39  value 22R  [R0402]  (hidden comment: Res2)
R40  Res2  [R0402]  (value not drawn)
R41  value 22R  [R0402]  (hidden comment: Res2)
R42  Res2  [R0402]  (value not drawn)
R43  value 22R  [R0402]  (hidden comment: Res2)
R44  Res2  [R0402]  (value not drawn)
R45  value 22R  [R0402]  (hidden comment: Res2)
R46  value 22R  [R0402]  (hidden comment: Res2)
R47  value 22R  [R0402]  (hidden comment: Res2)
R48  value 22R  [R0402]  (hidden comment: Res2)
R49  value 1K  [R0402]  (hidden comment: Res2)
R50  value 1K  [R0402]  (hidden comment: Res2)
R51  value 1K  [R0402]  (hidden comment: Res2)
R52  value 1K  [R0402]  (hidden comment: Res2)
R53  value 22R  [R0402]  (hidden comment: Res2)
R54  value 22R  [R0402]  (hidden comment: Res2)
R55  value 22R  [R0402]  (hidden comment: Res2)
R56  value 22R  [R0402]  (hidden comment: Res2)
R57  value 12.1K  Precision: 1%  [R0402]  (hidden comment: Res2)
R58  value 22R  [R0402]  (hidden comment: Res2)
R59  value 22R  [R0402]  (hidden comment: Res2)
R60  value 22R  [R0402]  (hidden comment: Res2)
TP1  (no value)  [TP_0MM5_1MM0]  (no BOM)
TP2  (no value)  [TP_0MM5_1MM0]  (no BOM)
U1  К5101НВ04FI  [VQFN48L]
U2  ADL5565  [CP_16_2_ADI-L]
U3  К5101НВ04FI  [VQFN48L]
U4  ADL5565  [CP_16_2_ADI-L]
U5  value LD1117S33TR  [SOT223]  (hidden comment: LD1117S12TR)
U6  value LD1117S18TR  [SOT223]  (hidden comment: LD1117S12TR)

### Ports
ADC0_CLK_N (in), ADC0_CLK_P (in), ADC0_CSn (in), ADC0_D[15..0] (out), ADC0_DCO (in), ADC0_OR (in), ADC1_CLK_N (in), ADC1_CLK_P (in), ADC1_CSn (in), ADC1_D[15..0] (out), ADC1_DCO (in), ADC1_N (in), ADC1_OR (in), ADC1_P (in), ADC2_N (in), ADC2_P (in), ADC_PWR (in), ADC_RESn (in), ADC_SDIO (in)

### Harnesses
ADC0: 0, 1, 2, 3, 4, 5, 6, 7, 8, 9, 11, 12, 10, 13, 14, 15, 16, 17, 18, 19, 70, 71, 74
ADC0: 0, 1, 2, 3, 4, 5, 6, 7, 8, 9, 11, 12, 10, 13, 14, 15, 16, 17, 18, 19, 72, 73, 75

### Nets
+1.8VA: C37.1 C38.1 C39.1 C40.1 L2.1 L4.1 TP2.1(e1) U6.2(Vout)
+2.5V: C3.1 C4.1 C18.1 C19.1 C36.1 U1.7(VddD) U1.12(VddD) U1.20(VddD) U3.7(VddD) U3.12(VddD) U3.20(VddD) U6.3(Vin) U6.4(GND)
+3.3VA: C32.1 C33.1 C34.1 C35.1 L1.1 L3.1 TP1.1(e1) U5.2(Vout)
+5.0V: C31.1 U5.3(Vin) U5.4(GND)
GND: C1.2 C2.2 C3.2 C4.2 C10.2 C11.2 C12.2 C13.2 C14.2 C15.2 C16.2 C17.2 C18.2 C19.2 C25.2 C26.2 C27.2 C28.2 C29.2 C30.2 C31.2 C32.2 C33.2 C34.2 C35.2 C36.2 C37.2 C38.2 C39.2 C40.2 R19.2 R20.2 R27.2 R49.2 R50.2 R57.2 U1.0(GND) U1.31(SENSE) U1.47(MODE) U2.0(PAD) U2.13(GND) U2.14(GND) U2.15(GND) U2.16(GND) U3.0(GND) U3.31(SENSE) U3.47(MODE) U4.0(PAD) U4.13(GND) U4.14(GND) U4.15(GND) U4.16(GND) U5.1(ADJ/GND) U6.1(ADJ/GND)  [project net +12V_INPUT]
ADC0_CLK_N: U1.35(CLKn) ; port ADC0_CLK_N, harness ADC0.17
ADC0_CLK_P: U1.34(CLKp) ; port ADC0_CLK_P, harness ADC0.16
ADC0_CSn: U1.48(nCS) ; port ADC0_CSn, harness ADC0.74
ADC0_D0: R3.2 ; harness ADC0.0
ADC0_D1: R4.2 ; harness ADC0.1
ADC0_D2: R5.2 ; harness ADC0.2
ADC0_D3: R6.2 ; harness ADC0.3
ADC0_D4: R9.2 ; harness ADC0.4
ADC0_D5: R11.2 ; harness ADC0.5
ADC0_D6: R13.2 ; harness ADC0.6
ADC0_D7: R15.2 ; harness ADC0.7
ADC0_D8: R16.2 ; harness ADC0.8
ADC0_D9: R17.2 ; harness ADC0.9
ADC0_D10: R18.2 ; harness ADC0.10
ADC0_D11: R23.2 ; harness ADC0.11
ADC0_D12: R24.2 ; harness ADC0.12
ADC0_D13: R25.2 ; harness ADC0.13
ADC0_D14: R26.2 ; harness ADC0.14
ADC0_D15: R28.2 ; harness ADC0.15
ADC0_DCO: R30.2 ; port ADC0_DCO, harness ADC0.19
ADC0_OR: R29.2 ; port ADC0_OR, harness ADC0.18
ADC1_CLK_N: U3.35(CLKn) ; port ADC1_CLK_N, harness ADC0.17
ADC1_CLK_P: U3.34(CLKp) ; port ADC1_CLK_P, harness ADC0.16
ADC1_CSn: U3.48(nCS) ; port ADC1_CSn, harness ADC0.75
ADC1_D0: R33.2 ; harness ADC0.0
ADC1_D1: R34.2 ; harness ADC0.1
ADC1_D2: R35.2 ; harness ADC0.2
ADC1_D3: R36.2 ; harness ADC0.3
ADC1_D4: R39.2 ; harness ADC0.4
ADC1_D5: R41.2 ; harness ADC0.5
ADC1_D6: R43.2 ; harness ADC0.6
ADC1_D7: R45.2 ; harness ADC0.7
ADC1_D8: R46.2 ; harness ADC0.8
ADC1_D9: R47.2 ; harness ADC0.9
ADC1_D10: R48.2 ; harness ADC0.10
ADC1_D11: R53.2 ; harness ADC0.11
ADC1_D12: R54.2 ; harness ADC0.12
ADC1_D13: R55.2 ; harness ADC0.13
ADC1_D14: R56.2 ; harness ADC0.14
ADC1_D15: R58.2 ; harness ADC0.15
ADC1_DCO: R60.2 ; port ADC1_DCO, harness ADC0.19
ADC1_OR: R59.2 ; port ADC1_OR, harness ADC0.18
ADC_PWR: U1.25(PD) U3.25(PD) ; port ADC_PWR, harness ADC0.71
ADC_RESn: U1.45(RESET) U3.45(RESET) ; port ADC_RESn, harness ADC0.70
ADC_SDIO: U1.46(SDIO) U3.46(SDIO) ; port ADC_SDIO, harness ADC0.72
NetC1_1: C1.1 C2.1 L2.2 U1.29(VddA) U1.32(VddA) U1.33(VddA) U1.36(VddA) U1.38(VddA) U1.41(VddA) U1.42(VddA) U1.43(VddA) U1.44(VddA)
NetC5_1: C5.1 U1.39(IN-)
NetC5_2: C5.2 C7.1 R21.1 U2.11(von)
NetC6_1: C6.1 R8.1 R10.1
NetC6_2: C6.2 R7.2 ; port ADC1_P
NetC7_2: C7.2 C8.2 R22.1 U2.9(vop)
NetC8_1: C8.1 U1.40(IN+)
NetC9_1: C9.1 R12.1 R14.1
NetC9_2: C9.2 R7.1 ; port ADC1_N
NetC10_1: C10.1 C11.1 L1.2 R1.1 R2.1 U2.5(Vcc) U2.6(Vcc) U2.7(Vcc) U2.8(Vcc)
NetC12_1: C12.1 R2.2 R20.1 U2.10(vcom)
NetC13_1: C13.1 C14.1 U1.28(VREF)
NetC15_1: C15.1 R21.2 R22.2
NetC16_1: C16.1 C17.1 L4.2 U3.29(VddA) U3.32(VddA) U3.33(VddA) U3.36(VddA) U3.38(VddA) U3.41(VddA) U3.42(VddA) U3.43(VddA) U3.44(VddA)
NetC20_1: C20.1 U3.39(IN-)
NetC20_2: C20.2 C22.1 R51.1 U4.11(von)
NetC21_1: C21.1 R38.1 R40.1
NetC21_2: C21.2 R37.2 ; port ADC2_P
NetC22_2: C22.2 C23.2 R52.1 U4.9(vop)
NetC23_1: C23.1 U3.40(IN+)
NetC24_1: C24.1 R42.1 R44.1
NetC24_2: C24.2 R37.1 ; port ADC2_N
NetC25_1: C25.1 R32.2 R50.1 U4.10(vcom)
NetC26_1: C26.1 C27.1 L3.2 R31.1 R32.1 U4.5(Vcc) U4.6(Vcc) U4.7(Vcc) U4.8(Vcc)
NetC28_1: C28.1 C29.1 U3.28(VREF)
NetC30_1: C30.1 R51.2 R52.2
NetR1_2: R1.2 R19.1 U2.12(en)
NetR3_1: R3.1 U1.3(D0)
NetR4_1: R4.1 U1.4(D1)
NetR5_1: R5.1 U1.5(D2)
NetR6_1: R6.1 U1.6(D3)
NetR8_2: R8.2 U2.1(vip2)
NetR9_1: R9.1 U1.8(D4)
NetR10_2: R10.2 U2.2(vip1)
NetR11_1: R11.1 U1.9(D5)
NetR12_2: R12.2 U2.3(vin1)
NetR13_1: R13.1 U1.10(D6)
NetR14_2: R14.2 U2.4(vin2)
NetR15_1: R15.1 U1.11(D7)
NetR16_1: R16.1 U1.14(D8)
NetR17_1: R17.1 U1.15(D9)
NetR18_1: R18.1 U1.16(D10)
NetR23_1: R23.1 U1.17(D11)
NetR24_1: R24.1 U1.18(D12)
NetR25_1: R25.1 U1.19(D13)
NetR26_1: R26.1 U1.21(D14)
NetR27_1: R27.1 U1.30(RBIAS)
NetR28_1: R28.1 U1.22(D15)
NetR29_1: R29.1 U1.23(OR)
NetR30_1: R30.1 U1.2(DCO)
NetR31_2: R31.2 R49.1 U4.12(en)
NetR33_1: R33.1 U3.3(D0)
NetR34_1: R34.1 U3.4(D1)
NetR35_1: R35.1 U3.5(D2)
NetR36_1: R36.1 U3.6(D3)
NetR38_2: R38.2 U4.1(vip2)
NetR39_1: R39.1 U3.8(D4)
NetR40_2: R40.2 U4.2(vip1)
NetR41_1: R41.1 U3.9(D5)
NetR42_2: R42.2 U4.3(vin1)
NetR43_1: R43.1 U3.10(D6)
NetR44_2: R44.2 U4.4(vin2)
NetR45_1: R45.1 U3.11(D7)
NetR46_1: R46.1 U3.14(D8)
NetR47_1: R47.1 U3.15(D9)
NetR48_1: R48.1 U3.16(D10)
NetR53_1: R53.1 U3.17(D11)
NetR54_1: R54.1 U3.18(D12)
NetR55_1: R55.1 U3.19(D13)
NetR56_1: R56.1 U3.21(D14)
NetR57_1: R57.1 U3.30(RBIAS)
NetR58_1: R58.1 U3.22(D15)
NetR59_1: R59.1 U3.23(OR)
NetR60_1: R60.1 U3.2(DCO)

Not connected (* = marked no-connect by the designer): U1 26(VREFn) 27(VREFp) 37(VCM); U3 26(VREFn) 27(VREFp) 37(VCM)

### Buses and harness runs
bus ADC0_D[15..0] = port ADC0_D[15..0]
bus ADC1_D[15..0] = port ADC1_D[15..0]

### Layout directives
net class ADC: (no net found under the mark)

### Notes on the sheet
- (near L1) 80мА  3.3В
- (near L2) 300мА  1.8В
- (near C3) 36мА  2.5В
- Резисторы определяют согласование
- (near L3) 80мА  3.3В
- (near L4) 300мА  1.8В
- (near C18) 36мА  2.5В
- Высокотоковые линейные стабилизаторы для развязки питания аналоговых цепей усилителей и АЦП.
- 160мА
- 680мА
- Потребление
  +5.0V   - 0.16A  0.8W
  +2.5V  - 0.68A  1.7W
- Лист
- /
- Изм.
- № докум.
- Подп.
- Дата.
- (in symbol ADL5565) +; -
- (in symbol К5101НВ04FI) ADC

### Library data of the parts
C1-C6 C8-C13 C15-C21 C23-C28 C30 C34 C39 = Cap: Конденсатор керамический; Voltage: 25V; PackageReference: 0402
  C1-C6 C8-C13 C15: ClassName: ADC-1
  C16-C21 C23-C28 C30: ClassName: ADC-2
  C34 C39: ClassName: ADC_POWER
C7 C14 C22 C29 C32 C33 C37 C38 = Cap: Конденсатор керамический
  C7: PackageReference: 0402; ClassName: ADC-1
  C14: PackageReference: 0603; ClassName: ADC-1
  C22: PackageReference: 0402; ClassName: ADC-2
  C29: PackageReference: 0603; ClassName: ADC-2
  C32 C33 C37 C38: PackageReference: 0603; ClassName: ADC_POWER
C31 C35 C36 C40 = Cap: C0805C476M9PAC; PackageReference: 0805; ClassName: Xilinx PWR
L1-L4 = BEAD_FERRITE_SM: as L14 on sheet Xilinx_DDR; PackageReference: 0402; Value: 742792780
  L1 L2: ClassName: ADC-1
  L3 L4: ClassName: ADC-2
R1-R7 R9 R11 R13 R15-R37 R39 R41 R43 R45-R60 = Res2: Резистор; PackageReference: 0402
  R1-R7 R9 R11 R13 R15-R30: ClassName: ADC-1
  R31-R37 R39 R41 R43 R45-R60: ClassName: ADC-2
R8 R10 R12 R14 R38 R40 R42 R44 = Res2: Резистор; Value: 0R; PackageReference: 0402
  R8 R10 R12 R14: ClassName: ADC-1
  R38 R40 R42 R44: ClassName: ADC-2
TP1 = Test_Point: Тестовая точка на плате; MarkPCB: +3.3V; ClassName: ADC_POWER
TP2 = Test_Point: Тестовая точка на плате; MarkPCB: +1.8V; ClassName: ADC_POWER
U1 U3 = К5101НВ04FI: АЦП 95мГц 14бит; PackageReference: VQFN48L; Value: К5101НВ04FI
  U1: ClassName: ADC-1
  U3: ClassName: ADC-2
U2 U4 = ADL5565: 6 GHz Differential Amplifier; Value: ADL5565; PackageReference: LFCSP-16
  U2: ClassName: ADC-1
  U4: ClassName: ADC-2
U5 = LD1117S12TR: Линейный стабилизатор +3.3V; PackageReference: SOT223; ClassName: ADC_POWER
U6 = LD1117S12TR: Линейный стабилизатор 1.8V; PackageReference: SOT223; ClassName: ADC_POWER